# Altium schematic sheet ESP32_Advanced training.SchDoc
size A2; SheetNumber: 1; SheetTotal: 1
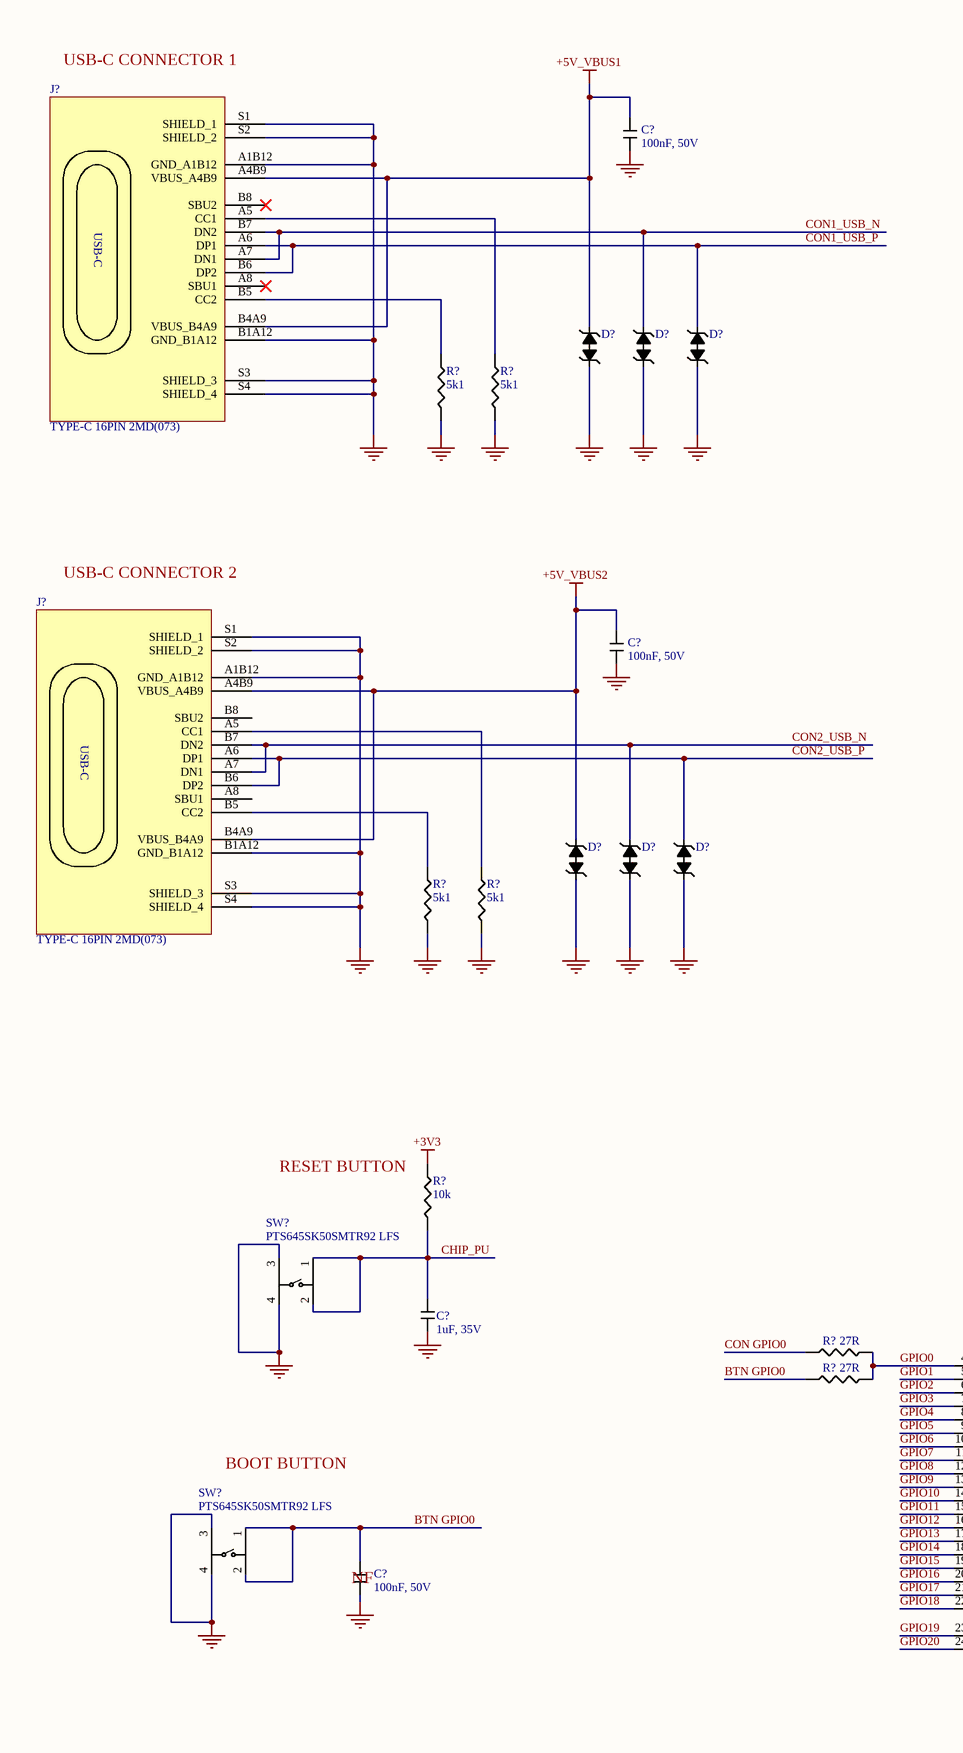
[diagram p0: ESP32_Advanced training.SchDoc, left]
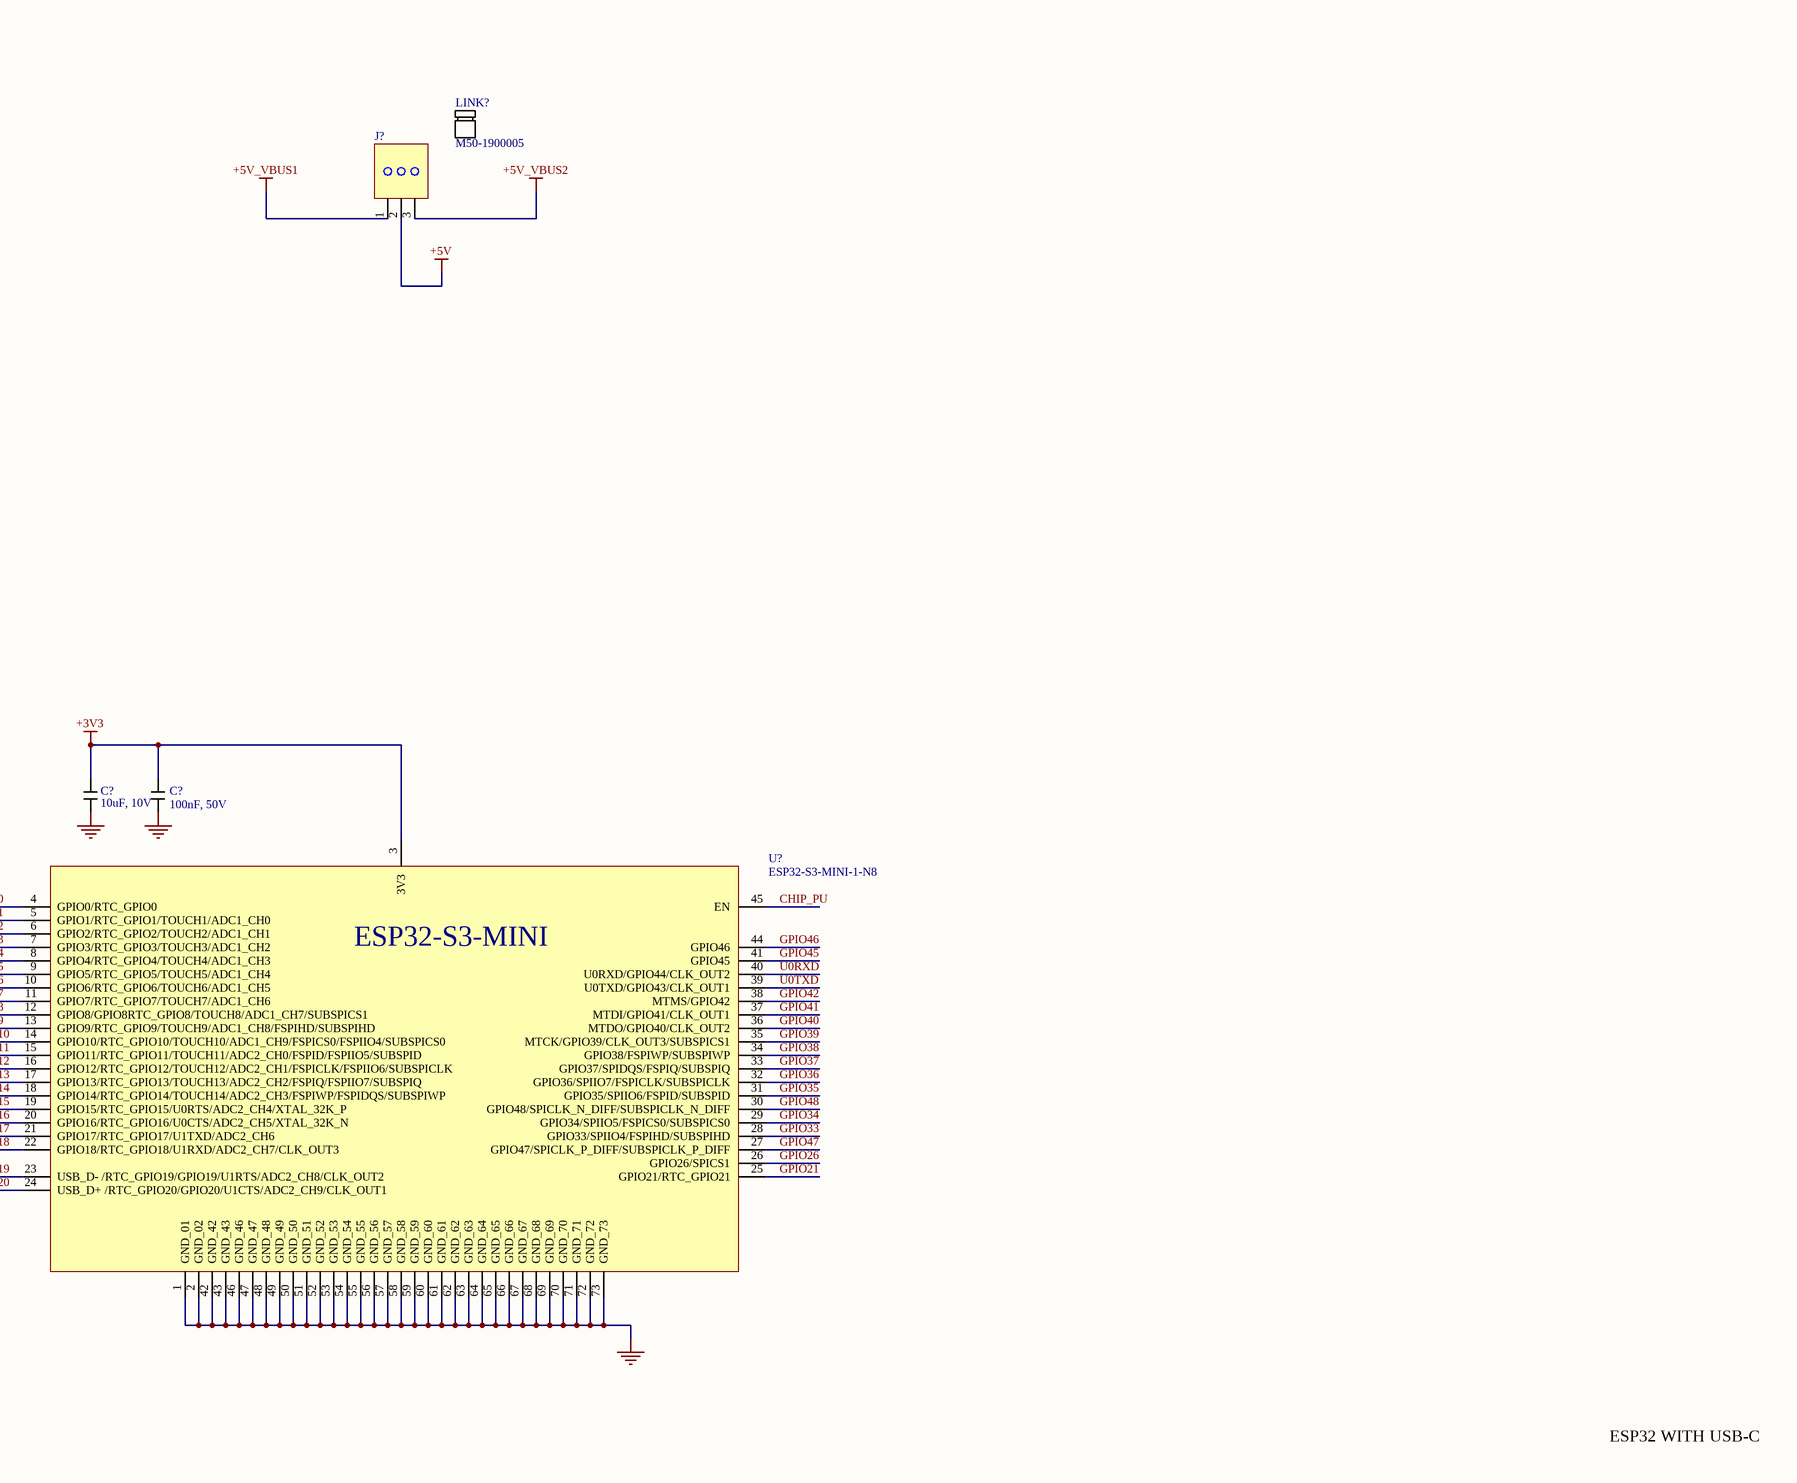
[diagram p1: ESP32_Advanced training.SchDoc, right]

## Parts
(Parts that share a designator on the sheet are numbered #1, #2 ... from top to bottom, then left to right.)
C?#1  100nF, 50V
C?#2  100nF, 50V
C?#3  100nF, 50V
C?#4  10uF, 10V
C?#5  1uF, 35V
C?#6  100nF, 50V
D?#1  LESD5D5.0CT1G  (value not drawn)
D?#2  LESD5D5.0CT1G  (value not drawn)
D?#3  LESD5D5.0CT1G  (value not drawn)
D?#4  LESD5D5.0CT1G  (value not drawn)
D?#5  LESD5D5.0CT1G  (value not drawn)
D?#6  LESD5D5.0CT1G  (value not drawn)
J?#1  TYPE-C 16PIN 2MD(073)
J?#2  male pin header  (value not drawn)
J?#3  TYPE-C 16PIN 2MD(073)
LINK?  M50-1900005
R?#1  5k1
R?#2  5k1
R?#3  5k1
R?#4  5k1
R?#5  10k
R?#6  27R
R?#7  27R
SW?#1  PTS645SK50SMTR92 LFS
SW?#2  PTS645SK50SMTR92 LFS
U?  ESP32-S3-MINI-1-N8

## Nets
+3V3: C?#3.2 C?#4.2 R?#5.2 U?.3(3V3)
+5V: J?#2.2
+5V_VBUS1: C?#1.2 D?#1.2 J?#1.A4B9(VBUS_A4B9) J?#1.B4A9(VBUS_B4A9) J?#2.1
+5V_VBUS2: C?#2.2 D?#4.2 J?#2.3 J?#3.A4B9(VBUS_A4B9) J?#3.B4A9(VBUS_B4A9)
GND: C?#1.1 C?#2.1 C?#3.1 C?#4.1 C?#5.1 C?#6.1 D?#1.1 D?#2.1 D?#3.1 D?#4.1 D?#5.1 D?#6.1 J?#1.A1B12(GND_A1B12) J?#1.B1A12(GND_B1A12) J?#1.S1(SHIELD_1) J?#1.S2(SHIELD_2) J?#1.S3(SHIELD_3) J?#1.S4(SHIELD_4) J?#3.A1B12(GND_A1B12) J?#3.B1A12(GND_B1A12) J?#3.S1(SHIELD_1) J?#3.S2(SHIELD_2) J?#3.S3(SHIELD_3) J?#3.S4(SHIELD_4) R?#1.1 R?#2.1 R?#3.1 R?#4.1 SW?#1.3 SW?#1.4 SW?#2.3 SW?#2.4 U?.1(GND_01) U?.2(GND_02) U?.42(GND_42) U?.43(GND_43) U?.46(GND_46) U?.47(GND_47) U?.48(GND_48) U?.49(GND_49) U?.50(GND_50) U?.51(GND_51) U?.52(GND_52) U?.53(GND_53) U?.54(GND_54) U?.55(GND_55) U?.56(GND_56) U?.57(GND_57) U?.58(GND_58) U?.59(GND_59) U?.60(GND_60) U?.61(GND_61) U?.62(GND_62) U?.63(GND_63) U?.64(GND_64) U?.65(GND_65) U?.66(GND_66) U?.67(GND_67) U?.68(GND_68) U?.69(GND_69) U?.70(GND_70) U?.71(GND_71) U?.72(GND_72) U?.73(GND_73)
BTN GPIO0: C?#6.2 R?#7.1 SW?#2.1 SW?#2.2
CHIP_PU: C?#5.2 R?#5.1 SW?#1.1 SW?#1.2 U?.45(EN)
CON1_USB_N: D?#2.2 J?#1.A7(DN1) J?#1.B7(DN2)
CON1_USB_P: D?#3.2 J?#1.A6(DP1) J?#1.B6(DP2)
CON2_USB_N: D?#5.2 J?#3.A7(DN1) J?#3.B7(DN2)
CON2_USB_P: D?#6.2 J?#3.A6(DP1) J?#3.B6(DP2)
CON GPIO0: R?#6.1
GPIO0: R?#6.2 R?#7.2 U?.4(GPIO0/RTC_GPIO0)
GPIO1: U?.5(GPIO1/RTC_GPIO1/TOUCH1/ADC1_CH0)
GPIO2: U?.6(GPIO2/RTC_GPIO2/TOUCH2/ADC1_CH1)
GPIO3: U?.7(GPIO3/RTC_GPIO3/TOUCH3/ADC1_CH2)
GPIO4: U?.8(GPIO4/RTC_GPIO4/TOUCH4/ADC1_CH3)
GPIO5: U?.9(GPIO5/RTC_GPIO5/TOUCH5/ADC1_CH4)
GPIO6: U?.10(GPIO6/RTC_GPIO6/TOUCH6/ADC1_CH5)
GPIO7: U?.11(GPIO7/RTC_GPIO7/TOUCH7/ADC1_CH6)
GPIO8: U?.12(GPIO8/GPIO8RTC_GPIO8/TOUCH8/ADC1_CH7/SUBSPICS1)
GPIO9: U?.13(GPIO9/RTC_GPIO9/TOUCH9/ADC1_CH8/FSPIHD/SUBSPIHD)
GPIO10: U?.14(GPIO10/RTC_GPIO10/TOUCH10/ADC1_CH9/FSPICS0/FSPIIO4/SUBSPICS0)
GPIO11: U?.15(GPIO11/RTC_GPIO11/TOUCH11/ADC2_CH0/FSPID/FSPIIO5/SUBSPID)
GPIO12: U?.16(GPIO12/RTC_GPIO12/TOUCH12/ADC2_CH1/FSPICLK/FSPIIO6/SUBSPICLK)
GPIO13: U?.17(GPIO13/RTC_GPIO13/TOUCH13/ADC2_CH2/FSPIQ/FSPIIO7/SUBSPIQ)
GPIO14: U?.18(GPIO14/RTC_GPIO14/TOUCH14/ADC2_CH3/FSPIWP/FSPIDQS/SUBSPIWP)
GPIO15: U?.19(GPIO15/RTC_GPIO15/U0RTS/ADC2_CH4/XTAL_32K_P)
GPIO16: U?.20(GPIO16/RTC_GPIO16/U0CTS/ADC2_CH5/XTAL_32K_N)
GPIO17: U?.21(GPIO17/RTC_GPIO17/U1TXD/ADC2_CH6)
GPIO18: U?.22(GPIO18/RTC_GPIO18/U1RXD/ADC2_CH7/CLK_OUT3)
GPIO19: U?.23(USB_D-_/RTC_GPIO19/GPIO19/U1RTS/ADC2_CH8/CLK_OUT2)
GPIO20: U?.24(USB_D+_/RTC_GPIO20/GPIO20/U1CTS/ADC2_CH9/CLK_OUT1)
GPIO21: U?.25(GPIO21/RTC_GPIO21)
GPIO26: U?.26(GPIO26/SPICS1)
GPIO33: U?.28(GPIO33/SPIIO4/FSPIHD/SUBSPIHD)
GPIO34: U?.29(GPIO34/SPIIO5/FSPICS0/SUBSPICS0)
GPIO35: U?.31(GPIO35/SPIIO6/FSPID/SUBSPID)
GPIO36: U?.32(GPIO36/SPIIO7/FSPICLK/SUBSPICLK)
GPIO37: U?.33(GPIO37/SPIDQS/FSPIQ/SUBSPIQ)
GPIO38: U?.34(GPIO38/FSPIWP/SUBSPIWP)
GPIO39: U?.35(MTCK/GPIO39/CLK_OUT3/SUBSPICS1)
GPIO40: U?.36(MTDO/GPIO40/CLK_OUT2)
GPIO41: U?.37(MTDI/GPIO41/CLK_OUT1)
GPIO42: U?.38(MTMS/GPIO42)
GPIO45: U?.41(GPIO45)
GPIO46: U?.44(GPIO46)
GPIO47: U?.27(GPIO47/SPICLK_P_DIFF/SUBSPICLK_P_DIFF)
GPIO48: U?.30(GPIO48/SPICLK_N_DIFF/SUBSPICLK_N_DIFF)
U0RXD: U?.40(U0RXD/GPIO44/CLK_OUT2)
U0TXD: U?.39(U0TXD/GPIO43/CLK_OUT1)
NetJ?#1_A5: J?#1.A5(CC1) R?#2.2
NetJ?#1_B5: J?#1.B5(CC2) R?#1.2
NetJ?#3_A5: J?#3.A5(CC1) R?#4.2
NetJ?#3_B5: J?#3.B5(CC2) R?#3.2

Not connected (* = marked no-connect by the designer): J?#1 A8(SBU1)* B8(SBU2)*; J?#3 A8(SBU1) B8(SBU2)

## Notes on the sheet
- USB-C CONNECTOR 1
- USB-C CONNECTOR 2
- (near R?#5) RESET BUTTON
- BOOT BUTTON
- (near C?#6) NF
- ESP32 WITH USB-C
- (in symbol ESP32-S3-MINI-1-N8) ESP32-S3-MINI
- (in symbol TYPE-C 16PIN 2MD(073)) USB-C

## Library data of the parts
C?#1-C?#3 C?#6 = CL05B104KB54PNC: CAP CER 0.1UF 50V X7R 0402; Manufacturer: Samsung; Dielectric Material: Ceramic; Supplier: Digikey; Supplier Part Number: 1276-CL05B104KB54PNCCT-ND; Manufacturer Part Number: CL05B104KB54PNC; RoHS: Yes; Category: Ceramic Capacitors; Stock: 492223; Pricing: 1=0.1, 10=0.036, 50=0.0246, 100=0.0211, 500=0.01508, 1000=0.0132, 2500=0.01122, 5000=0.01002 (USD); Pins: 2; Capacitor Type: Ceramic; RoHS Compliant: Yes; Reach SVHC Compliant: Yes; ComponentLink1URL: https://datasheet.ciiva.com:443/pdfs/VipMasterIC/IC/SEMS/SEMS-S-A0006318249/SEMS-S-A0006320959-1.pdf?src-supplier=IHS+Markit; ComponentLink1Description: https://datasheet.ciiva.com:443/pdfs/VipMasterIC/IC/SEMS/SEMS-S-A0006318249/SEMS-S-A0006320959-1.pdf?src-supplier=IHS+Markit; ComponentLink2URL: https://datasheet.octopart.com/CL05B104KB54PNC-Samsung-datasheet-8326407.pdf?src-supplier=TME; ComponentLink2Description: https://datasheet.octopart.com/CL05B104KB54PNC-Samsung-datasheet-8326407.pdf?src-supplier=TME; LCSC Part Number: C307331
C?#4 = CL05A106MP8NUB8: CAP CER 10UF 10V X5R 0402; Manufacturer: Samsung; Dielectric Material: Ceramic; Multilayer: Yes; Tolerance  (fill in as +-): 20%; Supplier: Digikey; Supplier Part Number: 1276-6830-1-ND; Manufacturer Part Number: CL05A106MP8NUB8; RoHS: Yes; Category: Ceramic Capacitors; Stock: 876592; Pricing: 1=0.33, 10=0.215, 50=0.1584, 100=0.129, 500=0.1018, 1000=0.08597, 2500=0.08145 (USD); Mounting Technology: Surface Mount; Pins: 2; Package Shape: Rectangular; Case/Package: 0402; Terminal Finish: Nickel; Min Operating Temperature: -55°C; Max Operating Temperature: 85°C; JESD-609 Code: e3; Value: 10uF; Capacitor Type: Ceramic; Packaging: Tape and Reel; Tolerance (fill in as +-): 20%; Rated DC Voltage (URdc): 10V; Temperature Characteristics Code: X5R; Termination: Wraparound; Reach SVHC Compliant: Yes; RoHS Compliant: Yes; ComponentLink1URL: https://datasheet.ciiva.com:443/pdfs/VipMasterIC/IC/SEMS/SEMS-S-A0008521219/SEMS-S-A0008521325-1.pdf?src-supplier=IHS+Markit; ComponentLink1Description: https://datasheet.ciiva.com:443/pdfs/VipMasterIC/IC/SEMS/SEMS-S-A0008521219/SEMS-S-A0008521325-1.pdf?src-supplier=IHS+Markit; ComponentLink2URL: http://www.samsungsem.com/kr/support/product-search/mlcc/CL05A106MP8NUB8.jsp?src-supplier=Digikey; ComponentLink2Description: http://www.samsungsem.com/kr/support/product-search/mlcc/CL05A106MP8NUB8.jsp?src-supplier=Digikey; ComponentLink3URL: https://datasheet.octopart.com/CL05A106MP8NUB8-Samsung-Electro-Mechanics-datasheet-136460857.pdf?src-supplier=Future+Electronics; ComponentLink3Description: https://datasheet.octopart.com/CL05A106MP8NUB8-Samsung-Electro-Mechanics-datasheet-136460857.pdf?src-supplier=Future+Electronics; LCSC Part Number: C307415
C?#5 = CL05A105KL5NRNC: CAP CER 1UF 35V X5R 0402; Manufacturer: Samsung; Dielectric Material: Ceramic; Multilayer: Yes; Tolerance  (fill in as +-): 10%; Supplier: Digikey; Supplier Part Number: 1276-6796-6-ND; Manufacturer Part Number: CL05A105KL5NRNC; RoHS: Yes; Category: Ceramic Capacitors; Stock: 304983; Pricing: 1=0.33, 10=0.212, 50=0.149, 100=0.1202, 500=0.08934, 1000=0.07818, 2500=0.07446, 5000=0.06887 (USD); Mounting Technology: Surface Mount; Pins: 2; Package Shape: Rectangular; Case/Package: 0402; Terminal Finish: Nickel; Min Operating Temperature: -55°C; Max Operating Temperature: 85°C; JESD-609 Code: e3; Value: 1uF; Capacitor Type: Ceramic; Packaging: Tape and Reel; Tolerance (fill in as +-): 10%; Rated DC Voltage (URdc): 35V; Temperature Characteristics Code: X5R; Termination: Wraparound; Reach SVHC Compliant: Yes; RoHS Compliant: Yes; ComponentLink1URL: https://datasheet.ciiva.com:443/pdfs/VipMasterIC/IC/SEMS/SEMS-S-A0008384515/SEMS-S-A0008872905-1.pdf?src-supplier=IHS+Markit; ComponentLink1Description: https://datasheet.ciiva.com:443/pdfs/VipMasterIC/IC/SEMS/SEMS-S-A0008384515/SEMS-S-A0008872905-1.pdf?src-supplier=IHS+Markit; ComponentLink2URL: http://www.samsungsem.com/kr/support/product-search/mlcc/CL05A105KL5NRNC.jsp?src-supplier=Digikey; ComponentLink2Description: http://www.samsungsem.com/kr/support/product-search/mlcc/CL05A105KL5NRNC.jsp?src-supplier=Digikey; LCSC Part Number: C307413
D?#1-D?#6 = LESD5D5.0CT1G: 9.4A 18.6V 5.6V Bidirectional 5V SOD-523 ESD and Surge Protection (TVS/ESD) ROHS; Manufacturer: LRC; Manufacturer Part Number: LESD5D5.0CT1G; Supplier: LCSC; Supplier Part Number: C383211; ComponentLink1Description: Datasheet; ComponentLink1URL: https://www.lcsc.com/datasheet/lcsc_datasheet_1912111437_LRC-LESD5D5-0CT1G_C383211.pdf
J?#1 J?#3 = TYPE-C 16PIN 2MD(073): 5A 1 Horizontal attachment 16P Female -25℃~+85℃ Type-C SMD USB Connectors ROHS; Manufacturer: SHOU HAN; ComponentLink1Description: Datasheet; ComponentLink1URL: https://www.lcsc.com/datasheet/lcsc_datasheet_2111231930_SHOU-HAN-TYPE-C-16PIN-2MD-073_C2765186.pdf; Manufacturer Part Number: TYPE-C 16PIN 2MD(073); Supplier: LCSC; Supplier Part Number: C2765186
J?#2 = 1.27-1*3P: 3A Direct Insert Policy 1mm 3P 3mm -55℃~+105℃ 2.3mm 1.27mm Single Row Black Brass 1x3P Plugin,P=1.27mm Pin Headers ROHS; Manufacturer: BOOMELE(Boom Precision Elec); Manufacturer Part Number: 1.27-1*3P; Supplier: LCSC; Supplier Part Number: C24980; ComponentLink1Description: Datasheet; ComponentLink1URL: *
LINK? = M50-1900005: 2 (1 x 2) Position Shunt Connector Black Closed Top 0.050" (1.27mm) Gold; Manufacturer: Harwin Inc.; Manufacturer Part Number: M50-1900005; Supplier: LCSC; Supplier Part Number: C6293276; ComponentLink1Description: Datasheet; ComponentLink1URL: https://www.lcsc.com/datasheet/lcsc_datasheet_2312100117_Harwin-M50-1900005_C6293276.pdf
R?#1-R?#4 = AC0402FR-075K1L: RES SMD 5.1K OHM 1% 1/16W 0402; Manufacturer: YAGEO; Manufacturer Part Number: AC0402FR-075K1L; Supplier: LCSC; Supplier Part Number: C144745; ComponentLink1Description: Datasheet; ComponentLink1URL: https://www.lcsc.com/datasheet/lcsc_datasheet_2304140030_YAGEO-AC0402FR-075K1L_C144745.pdf
R?#5 = AC0402FR-0710KL: 10 kOhms ±1% 0.063W, 1/16W Chip Resistor 0402 (1005 Metric) Automotive AEC-Q200, Moisture Resistant Thick Film; Manufacturer: YAGEO; Manufacturer Part Number: AC0402FR-0710KL; Supplier: LCSC; Supplier Part Number: C144807
R?#6 R?#7 = RC0402FR-0710KL: RES 27 OHM 1% 1/16W 0402; Manufacturer: YAGEO; Manufacturer Part Number: RC0402FR-0727RL; ComponentLink1Description: datasheet; ComponentLink1URL: https://www.lcsc.com/datasheet/lcsc_datasheet_2304140030_YAGEO-RC0402FR-0727RL_C138021.pdf; Supplier: LCSC; Supplier Part Number: C138021
SW?#1 SW?#2 = PTS645SK50SMTR92 LFS: SWITCH TACTILE SPST-NO 0.05A 12V; Manufacturer: C&K; Manufacturer Part Number: PTS645SK50SMTR92 LFS; Supplier: LCSC; Supplier Part Number: C221872
U? = ESP32-S3-MINI-1-N8: SMD module, ESP32-S3FN8, 8 MB SPI flash, PCB antenna; Manufacturer: Espressif Systems; Supplier: Digikey; Supplier Part Number: 1965-ESP32-S3-MINI-1-N8CT-ND; Manufacturer Part Number: ESP32-S3-MINI-1-N8; RoHS: No; Category: LDO; Stock: 17589; Pricing: 1=3.1 (USD); ComponentLink1URL: https://datasheet.octopart.com/ESP32-S3-MINI-1-N8-Espressif-Systems-datasheet-165560562.pdf?src-supplier=TME; ComponentLink1Description: https://datasheet.octopart.com/ESP32-S3-MINI-1-N8-Espressif-Systems-datasheet-165560562.pdf?src-supplier=TME; LCSC Part Number: C2913206